# Altium project UWB_Anchor.PrjPcb
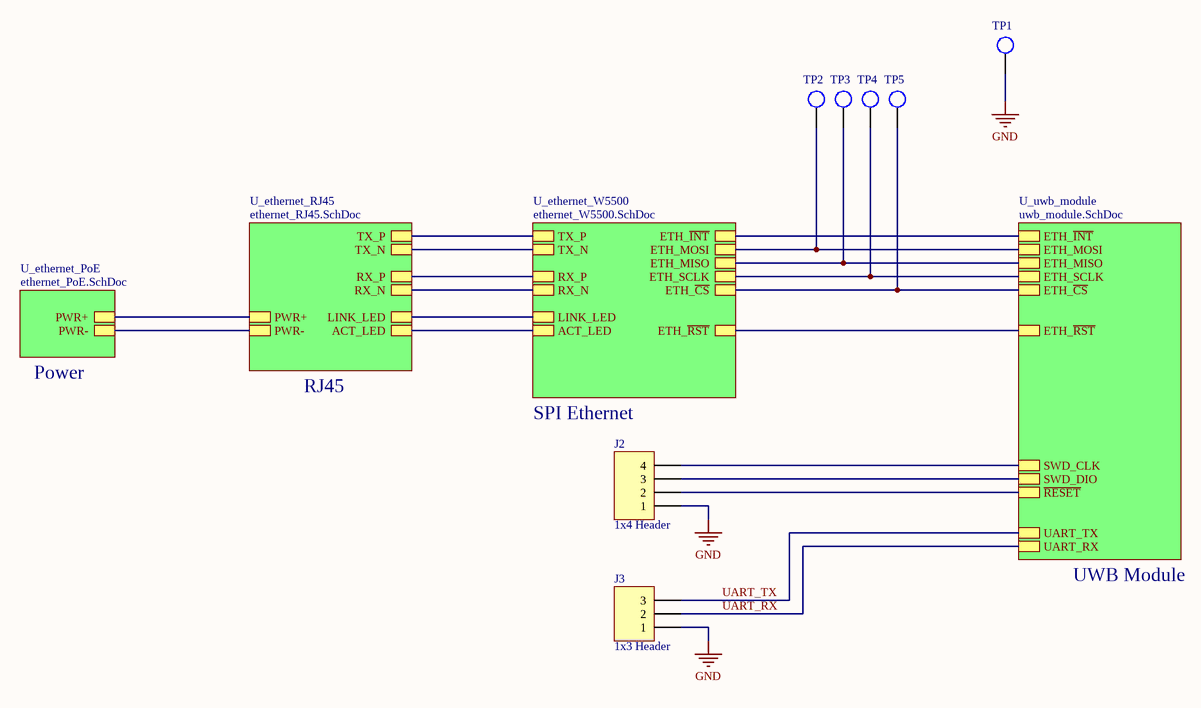
[diagram p0: main.SchDoc]
5 sheets, 101 parts. Net scope: hierarchical (ports join the sheet entries above them; power ports are global).
Board file: board.PcbDoc
Sheets:
  main.SchDoc
    U_ethernet_PoE = ethernet_PoE.SchDoc
    U_ethernet_RJ45 = ethernet_RJ45.SchDoc
    U_ethernet_W5500 = ethernet_W5500.SchDoc
    U_uwb_module = uwb_module.SchDoc

## Sheet main.SchDoc
size A4; SheetNumber: 1; SheetTotal: 5

### Parts
J2  1x4 Header  [HDR1X4]
J3  1x3 Header  [HDR1X3]
TP1  Test Point  [Test Point]  (value not drawn)  (no BOM)
TP2  Test Point  [Test Point]  (value not drawn)  (no BOM)
TP3  Test Point  [Test Point]  (value not drawn)  (no BOM)
TP4  Test Point  [Test Point]  (value not drawn)  (no BOM)
TP5  Test Point  [Test Point]  (value not drawn)  (no BOM)

### Sub-sheets
U_ethernet_PoE = ethernet_PoE.SchDoc: PWR-, PWR+
U_ethernet_RJ45 = ethernet_RJ45.SchDoc: LINK_LED, ACT_LED, TX_P, TX_N, RX_P, RX_N, PWR+, PWR-
U_ethernet_W5500 = ethernet_W5500.SchDoc: ETH_MOSI, ETH_MISO, ETH_SCLK, LINK_LED, ACT_LED, TX_P, TX_N, RX_P, RX_N, ETH_~{INT}, ETH_~{CS}, ETH_~{RST}
U_uwb_module = uwb_module.SchDoc: SWD_CLK, SWD_DIO, ETH_~{CS}, ETH_MOSI, ETH_MISO, ETH_SCLK, ETH_~{INT}, ETH_~{RST}, UART_TX, UART_RX, ~{RESET}

### Nets
GND: J2.1 J3.1 TP1.1
ACT_LED: sheet U_ethernet_RJ45/ACT_LED, sheet U_ethernet_W5500/ACT_LED
ETH_~{CS}: TP5.1 ; sheet U_ethernet_W5500/ETH_~{CS}, sheet U_uwb_module/ETH_~{CS}
ETH_~{INT}: sheet U_ethernet_W5500/ETH_~{INT}, sheet U_uwb_module/ETH_~{INT}
ETH_MISO: TP3.1 ; sheet U_ethernet_W5500/ETH_MISO, sheet U_uwb_module/ETH_MISO
ETH_MOSI: TP2.1 ; sheet U_ethernet_W5500/ETH_MOSI, sheet U_uwb_module/ETH_MOSI
ETH_~{RST}: sheet U_ethernet_W5500/ETH_~{RST}, sheet U_uwb_module/ETH_~{RST}
ETH_SCLK: TP4.1 ; sheet U_ethernet_W5500/ETH_SCLK, sheet U_uwb_module/ETH_SCLK
LINK_LED: sheet U_ethernet_RJ45/LINK_LED, sheet U_ethernet_W5500/LINK_LED
PWR+: sheet U_ethernet_PoE/PWR+, sheet U_ethernet_RJ45/PWR+
PWR-: sheet U_ethernet_PoE/PWR-, sheet U_ethernet_RJ45/PWR-
~{RESET}: J2.2 ; sheet U_uwb_module/~{RESET}
RX_N: sheet U_ethernet_RJ45/RX_N, sheet U_ethernet_W5500/RX_N
RX_P: sheet U_ethernet_RJ45/RX_P, sheet U_ethernet_W5500/RX_P
TX_N: sheet U_ethernet_RJ45/TX_N, sheet U_ethernet_W5500/TX_N
TX_P: sheet U_ethernet_RJ45/TX_P, sheet U_ethernet_W5500/TX_P
UART_RX: J3.2 ; sheet U_uwb_module/UART_RX
UART_TX: J3.3 ; sheet U_uwb_module/UART_TX
NetJ2_3: J2.3 ; sheet U_uwb_module/SWD_DIO
NetJ2_4: J2.4 ; sheet U_uwb_module/SWD_CLK

### Notes on the sheet
- Power
- RJ45
- (near J2) SPI Ethernet
- UWB Module

### Library data of the parts
J2 = 1x4 Header: 1x4 Pin Header
J3 = 1x3 Header: 1x3 Pin Header

## Sheet ethernet_PoE.SchDoc
size A4; SheetNumber: 3; SheetTotal: 5
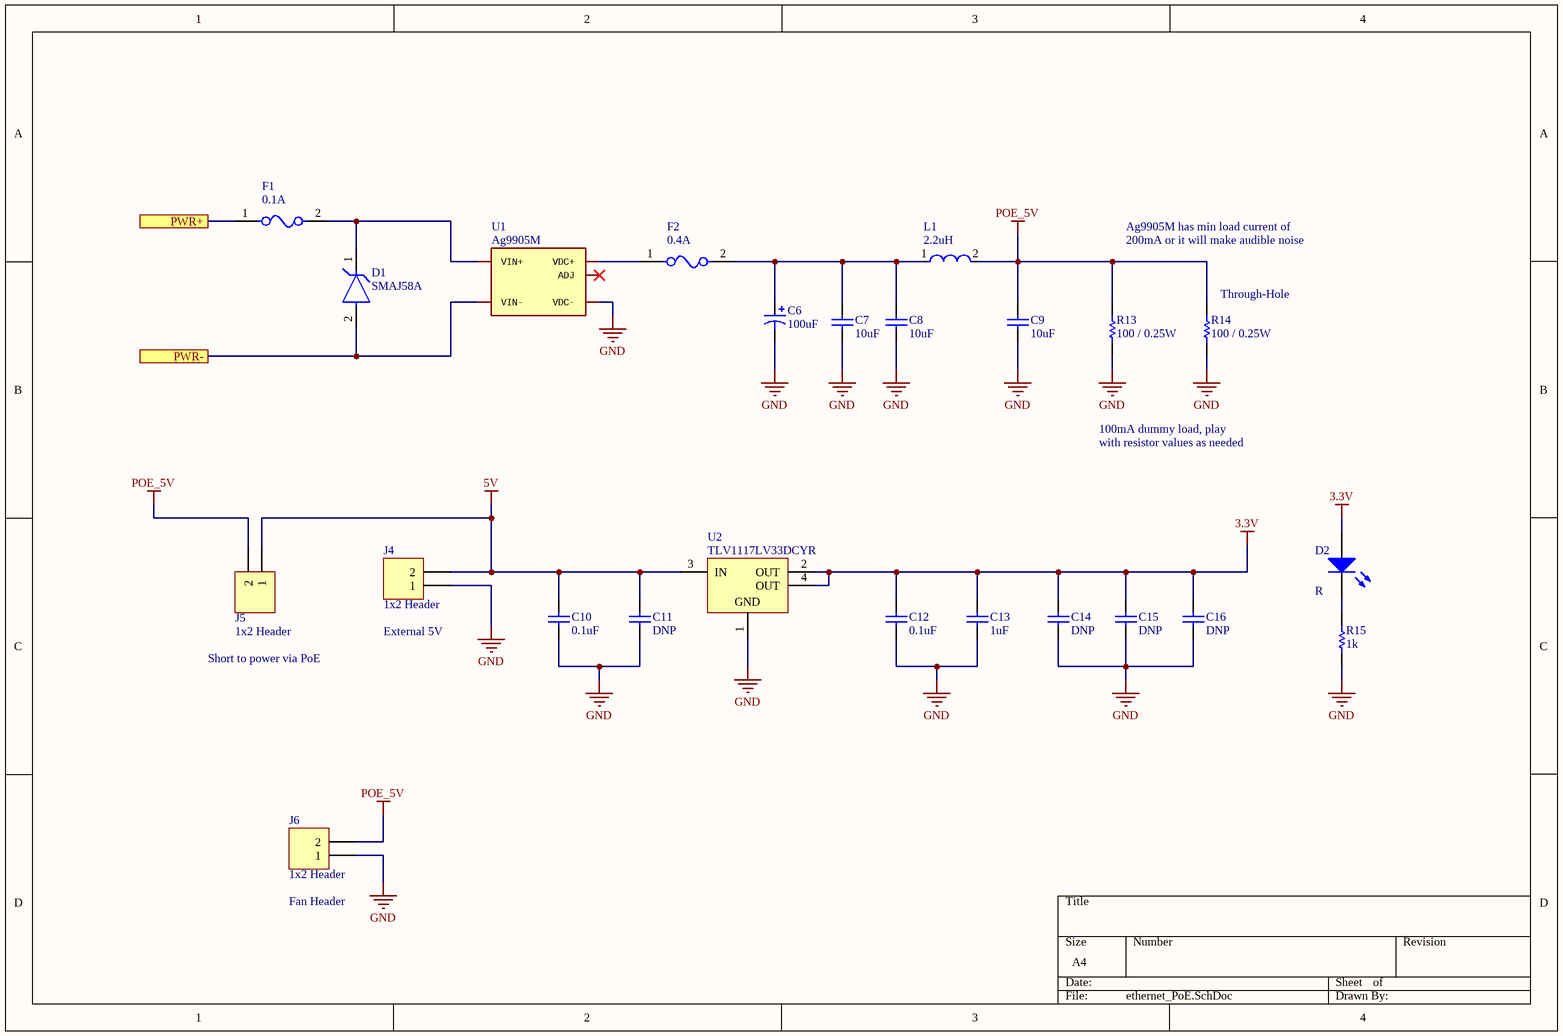
[diagram p1: ethernet_PoE.SchDoc]

### Parts
C6  value 100uF  [CAPPRD350W60D825H1300]  (hidden comment: Capacitor - Polarized)
C7  value 10uF  [0603 - Capacitor]  (hidden comment: Capacitor - Nonpolarized)
C8  value 10uF  [0603 - Capacitor]  (hidden comment: Capacitor - Nonpolarized)
C9  value 10uF  [0603 - Capacitor]  (hidden comment: Capacitor - Nonpolarized)
C10  value 0.1uF  [0603 - Capacitor]  (hidden comment: Capacitor - Nonpolarized)
C11  value DNP  [0603 - Capacitor]  (hidden comment: Capacitor - Nonpolarized)
C12  value 0.1uF  [0603 - Capacitor]  (hidden comment: Capacitor - Nonpolarized)
C13  value 1uF  [0603 - Capacitor]  (hidden comment: Capacitor - Nonpolarized)
C14  value DNP  [0603 - Capacitor]  (hidden comment: Capacitor - Nonpolarized)
C15  value DNP  [0603 - Capacitor]  (hidden comment: Capacitor - Nonpolarized)
C16  value DNP  [0603 - Capacitor]  (hidden comment: Capacitor - Nonpolarized)
D1  SMAJ58A  [FP-SMAJ-MFG]
D2  LED  [0805 LED]  (value not drawn)
F1  696101000002  [Wurth_0_MFG]  (value not drawn)
F2  696101000002  [Wurth_0_MFG]  (value not drawn)
J4  1x2 Header  [HDR1X2]
J5  1x2 Header  [HDR1X2]
J6  1x2 Header  [HDR1X2]
L1  2.2uH  [FP-DFE252010C-IPC_A]
R13  value 100 / 0.25W  [RESAD1100W55L680D260]  (hidden comment: Resistor)
R14  value 100 / 0.25W  [RESAD1100W55L680D260]  (hidden comment: Resistor)
R15  value 1k  [0603 - Resistor]  (hidden comment: Resistor)
U1  Ag9905M  [Ag9900m]
U2  TLV1117LV33DCYR  [DCY0004A_N]

### Ports
PWR+ (see main[1B]), PWR- (see main[1B])

### Nets
3.3V: C12.2 C13.2 C14.2 C15.2 C16.2 D2.1(A) U2.2(OUT) U2.4(OUT)
5V: C10.2 C11.2 J4.2 J5.1 U2.3(IN)
GND: C6.2 C7.1 C8.1 C9.1 C10.1 C11.1 C12.1 C13.1 C14.1 C15.1 C16.1 J4.1 J6.1 R13.1 R14.1 R15.1 U1.3(VDC-) U2.1(GND)
POE_5V: C9.2 J5.2 J6.2 L1.2 R13.2 R14.2
PWR+: F1.1 ; port PWR+
PWR-: D1.2(A) U1.7,8(VIN-) ; port PWR-
NetC6_1: C6.1 C7.2 C8.2 F2.2 L1.1
NetD1_1: D1.1(C) F1.2 U1.5,6(VIN+)
NetD2_2: D2.2(K) R15.2
NetF2_1: F2.1 U1.1,2(VDC+)

Not connected (* = marked no-connect by the designer): U1 4(ADJ)*

### Notes on the sheet
- (near F1) 0.1A
- (near F2) 0.4A
- Ag9905M has min load current of
- 200mA or it will make audible noise
- (near R14) Through-Hole
- 100mA dummy load, play
- with resistor values as needed
- (near J4) External 5V
- R
- Short to power via PoE
- (near J6) Fan Header

### Library data of the parts
C6 = Capacitor - Polarized: Polarized Capacitor; Manufacturer: Lelon; Manufacturer Part Number: RGA101M1HBK-0811G; Rating: 50V; Supplier: Mouser; Supplier Part Number: 140-RGA101M1HBK0811G; Link: https://www.mouser.ca/ProductDetail/Lelon/RGA101M1HBK-0811G?qs=pNDdEcSXiOBNivHdElCSJA%3D%3D
C7-C10 C12 = Capacitor - Nonpolarized: Nonpolarized Capacitor; Manufacturer: YAGEO; Manufacturer Part Number: CC0603KRX7R9BB104; Rating: 50V X7R +/-10%; Supplier Part Number: C14663; Supplier: JLCPCB; Link: https://jlcpcb.com/partdetail/Yageo-CC0603KRX7R9BB104/C14663
C11 C14-C16 = Capacitor - Nonpolarized: Nonpolarized Capacitor; Supplier Part Number: *; Supplier: *; Manufacturer: *; Rating: *; Manufacturer Part Number: *
C13 = Capacitor - Nonpolarized: Nonpolarized Capacitor; Manufacturer: Samsung Electro-Mechanics; Manufacturer Part Number: CL10A105KB8NNNC; Rating: 50V; Supplier Part Number: C15849; Supplier: JLCPCB; Link: https://jlcpcb.com/partdetail/16531-CL10A105KB8NNNC/C15849
D1 = CMP-08607-000100-1: TVS DIODE 58V 93.6V DO214AC; Manufacturer: Murata Electronics; Manufacturer Part Number: BLM21AG121SH1D; Link: https://www.mouser.ca/ProductDetail/Murata-Electronics/BLM21AG121SH1D?qs=RTwwdbUDBXC774LJBjqxGQ%3D%3D; Supplier: Mouser; Supplier Part Number: 81-BLM21AG121SH1D
D2 = LED: Light Emitting Diode; Manufacturer Part Number: NCD0805R1; Manufacturer: Foshan NationStar Optoelectronics; Value: *; Supplier Part Number: C84256; Rating: *; Supplier: JLCPCB; Link: https://jlcpcb.com/partdetail/85425-NCD0805R1/C84256
F1 F2 = 696101000002: Manufacturer: Wurth Elektronik; Link: https://www.mouser.ca/ProductDetail/Wurth-Elektronik/696101000002?qs=sGAEpiMZZMuxTAA0eeO5G4B6PR9Rh8ggTQiUs4G0%252BG%2FdkdTX7N7tpQ%3D%3D; Manufacturer Part Number: 696101000002; Supplier: Mouser; Supplier Part Number: 710-696101000002
J4-J6 = 1x2 Header: 1x2 Pin Header
L1 = CMP-06042-014626-1: Shielded Wirewound Inductor 2.2uH  1700mA 0.115Ω 1008 (2520); Manufacturer: Murata Electronics; Manufacturer Part Number: DFE252010P-2R2M=P2; Link: https://jlcpcb.com/parts/componentSearch?searchTxt=DFE252010P-2R2M%3DP2; Supplier: JLCPCB; Supplier Part Number: C882952
R15 = Resistor: Manufacturer Part Number: 0603WAF1001T5E; Manufacturer: UNI-ROYAL(Uniroyal Elec); Rating: 100mW; Supplier Part Number: C21190; Supplier: JLCPCB; Link: https://jlcpcb.com/partdetail/21904-0603WAF1001T5E/C21190
U1 = Ag99005M: pin to pad: 1,2>1+2 5,6>5+6 7,8>7+8; Manufacturer: Silvertel; Link: https://www.mouser.ca/ProductDetail/Silvertel/Ag9905M?qs=OlC7AqGiEDnwSueIfRW6OQ%3D%3D; Manufacturer Part Number: Ag9905M; Supplier: Mouser; Supplier Part Number: 480-AG9905M
U2 = CMP-0395-00503-2: Single Output LDO, 1 A, Fixed 3.3 V Output, 2 to 5.5 V Input, 4-pin SOT-223 (DCY), -40 to 125 degC, Green (RoHS & no Sb/Br); Manufacturer: Texas Instruments; Link: https://jlcpcb.com/partdetail/TexasInstruments-TLV1117LV33DCYR/C15578; Manufacturer Part Number: TLV1117LV33DCYR; Supplier: JLCPCB; Supplier Part Number: C15578

## Sheet ethernet_RJ45.SchDoc
size A4; SheetNumber: 2; SheetTotal: 5
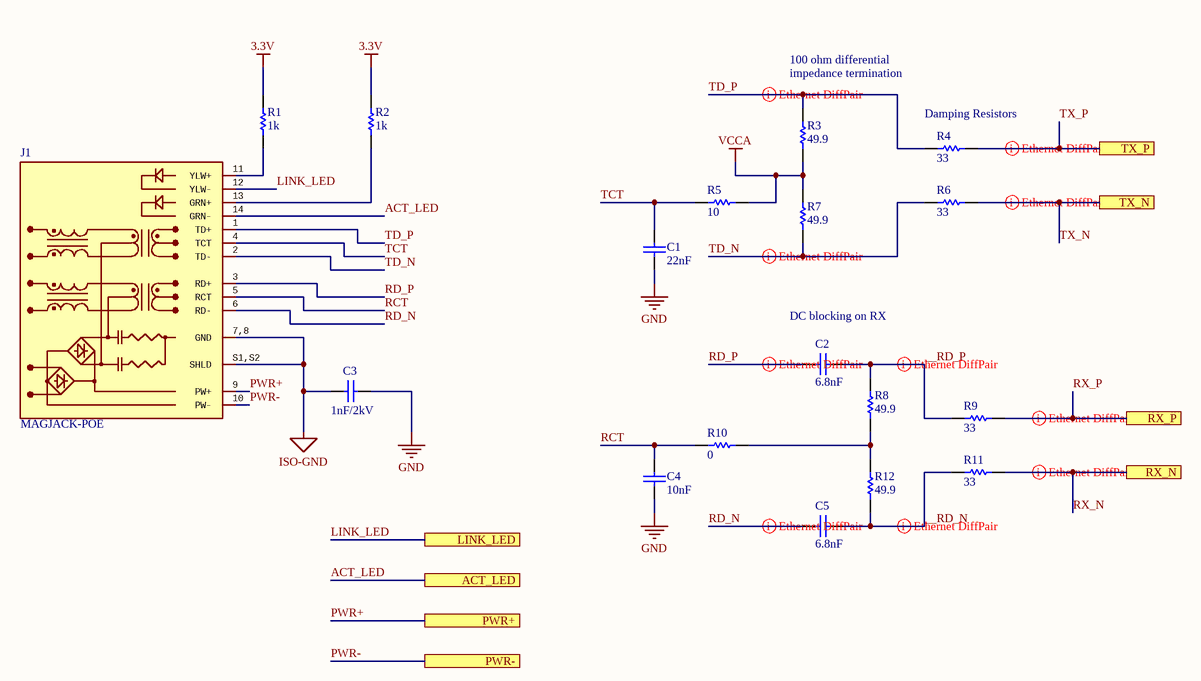
[diagram p2: ethernet_RJ45.SchDoc]

### Parts
C1  value 22nF  [0603 - Capacitor]  (hidden comment: Capacitor - Nonpolarized)
C2  value 6.8nF  [0603 - Capacitor]  (hidden comment: Capacitor - Nonpolarized)
C3  value 1nF/2kV  [1206 - Capacitor]  (hidden comment: Capacitor - Nonpolarized)
C4  value 10nF  [0603 - Capacitor]  (hidden comment: Capacitor - Nonpolarized)
C5  value 6.8nF  [0603 - Capacitor]  (hidden comment: Capacitor - Nonpolarized)
J1  MAGJACK-POE  [ARJP11A-MASA-B-A-EMU2]
R1  value 1k  [0603 - Resistor]  (hidden comment: Resistor)
R2  value 1k  [0603 - Resistor]  (hidden comment: Resistor)
R3  value 49.9  [0603 - Resistor]  (hidden comment: Resistor)
R4  value 33  [0603 - Resistor]  (hidden comment: Resistor)
R5  value 10  [0603 - Resistor]  (hidden comment: Resistor)
R6  value 33  [0603 - Resistor]  (hidden comment: Resistor)
R7  value 49.9  [0603 - Resistor]  (hidden comment: Resistor)
R8  value 49.9  [0603 - Resistor]  (hidden comment: Resistor)
R9  value 33  [0603 - Resistor]  (hidden comment: Resistor)
R10  value 0  [0603 - Resistor]  (hidden comment: Resistor)
R11  value 33  [0603 - Resistor]  (hidden comment: Resistor)
R12  value 49.9  [0603 - Resistor]  (hidden comment: Resistor)

### Ports
ACT_LED (see main[2B]), LINK_LED (see main[2B]), PWR+ (see main[2B]), PWR- (see main[2B]), RX_N (see main[2B]), RX_P (see main[2B]), TX_N (see main[2B]), TX_P (see main[2B])

### Nets
3.3V: R1.2 R2.2
GND: C1.1 C3.1 C4.1
ISO-GND: C3.2 J1.7,8(GND) J1.S1,S2(SHLD)
VCCA: R3.1 R5.1 R7.2
__RD_N: C5.1 R11.2 R12.1
__RD_P: C2.1 R8.2 R9.2
ACT_LED: J1.14(GRN-) ; port ACT_LED
LINK_LED: J1.12(YLW-) ; port LINK_LED
PWR+: J1.9(PW+) ; port PWR+
PWR-: J1.10(PW-) ; port PWR-
RCT: C4.2 J1.5(RCT) R10.2
RD_N: C5.2 J1.6(RD-)
RD_P: C2.2 J1.3(RD+)
RX_N: R11.1 ; port RX_N
RX_P: R9.1 ; port RX_P
TCT: C1.2 J1.4(TCT) R5.2
TD_N: J1.2(TD-) R6.2 R7.1
TD_P: J1.1(TD+) R3.2 R4.2
TX_N: R6.1 ; port TX_N
TX_P: R4.1 ; port TX_P
NetJ1_11: J1.11(YLW+) R1.1
NetJ1_13: J1.13(GRN+) R2.1
NetR8_1: R8.1 R10.1 R12.2

### Layout directives
differential pair; differential pair class Ethernet: __RD_N, __RD_P, RD_N, RD_P, RX_N, RX_P, TD_N, TD_P, TX_N, TX_P

### Notes on the sheet
- 100 ohm differential
- (near R3) impedance termination
- (near R4) Damping Resistors
- (near C2) DC blocking on RX

### Library data of the parts
C1 = Capacitor - Nonpolarized: Nonpolarized Capacitor; Manufacturer: Samsung Electro-Mechanics; Manufacturer Part Number: CL10B223KB8NNNC; Rating: 50V X7R +/-10%; Supplier Part Number: C21122; Supplier: JLCPCB; Link: https://jlcpcb.com/parts/componentSearch?searchTxt=C21122
C2 C5 = Capacitor - Nonpolarized: Nonpolarized Capacitor; Manufacturer: FH (Guangdong Fenghua Advanced Tech); Manufacturer Part Number: 0603B682K500NT; Rating: 50V X7R +/-10%; Supplier Part Number: C1631; Supplier: JLCPCB; Link: https://jlcpcb.com/partdetail/1983-0603B682K500NT/C1631
C3 = Capacitor - Nonpolarized: Nonpolarized Capacitor; Manufacturer: FH (Guangdong Fenghua Advanced Tech); Manufacturer Part Number: 1206B102K202NT; Rating: 2kV; Supplier Part Number: C9196; Supplier: JLCPCB; Link: https://jlcpcb.com/partdetail/9721-1206B102K202NT/C9196
C4 = Capacitor - Nonpolarized: Nonpolarized Capacitor; Manufacturer: FH (Guangdong Fenghua Advanced Tech); Manufacturer Part Number: 0603B103K500NT; Rating: 50V X7R +/-10%; Supplier Part Number: C57112; Supplier: JLCPCB; Link: https://jlcpcb.com/partdetail/58143-0603B103K500NT/C57112
J1 = ARJP11A-MASA-B-A-EMU2: pin to pad: 7,8>7+8 S1,S2>S1+S2; Manufacturer: ABRACON; Link: https://www.mouser.ca/ProductDetail/ABRACON/ARJP11A-MASA-B-A-EMU2?qs=Hi7jo9HHk1p0O4X8NyvNug%3D%3D; Manufacturer Part Number: ARJP11A-MASA-B-A-EMU2; Supplier: Mouser; Supplier Part Number: 815-RJP11AMASABAEMU2
R1 R2 = Resistor: as R15 on sheet ethernet_PoE; Supplier Part Number: C21190; Supplier: JLCPCB; Link: https://jlcpcb.com/partdetail/21904-0603WAF1001T5E/C21190
R3 R7 R8 R12 = Resistor: Manufacturer Part Number: 0603WAF499JT5E; Manufacturer: UNI-ROYAL(Uniroyal Elec); Rating: 100mW; Supplier Part Number: C23185; Supplier: JLCPCB; Link: https://jlcpcb.com/partdetail/23912-0603WAF499JT5E/C23185
R4 R6 R9 R11 = Resistor: Manufacturer Part Number: 0603WAF330JT5E; Manufacturer: UNI-ROYAL(Uniroyal Elec); Rating: 100mW; Supplier Part Number: C23140; Supplier: JLCPCB; Link: https://jlcpcb.com/partdetail/23867-0603WAF330JT5E/C23140
R5 = Resistor: Manufacturer Part Number: 0603WAF100JT5E; Manufacturer: UNI-ROYAL(Uniroyal Elec); Rating: 100mW; Supplier Part Number: C22859; Supplier: JLCPCB; Link: https://jlcpcb.com/partdetail/23586-0603WAF100JT5E/C22859
R10 = Resistor: Manufacturer Part Number: 0603WAF0000T5E; Manufacturer: UNI-ROYAL(Uniroyal Elec); Rating: 100mW; Supplier Part Number: C21189; Supplier: JLCPCB; Link: https://jlcpcb.com/partdetail/21903-0603WAF0000T5E/C21189

## Sheet ethernet_W5500.SchDoc
size A4; SheetNumber: 5; SheetTotal: 5
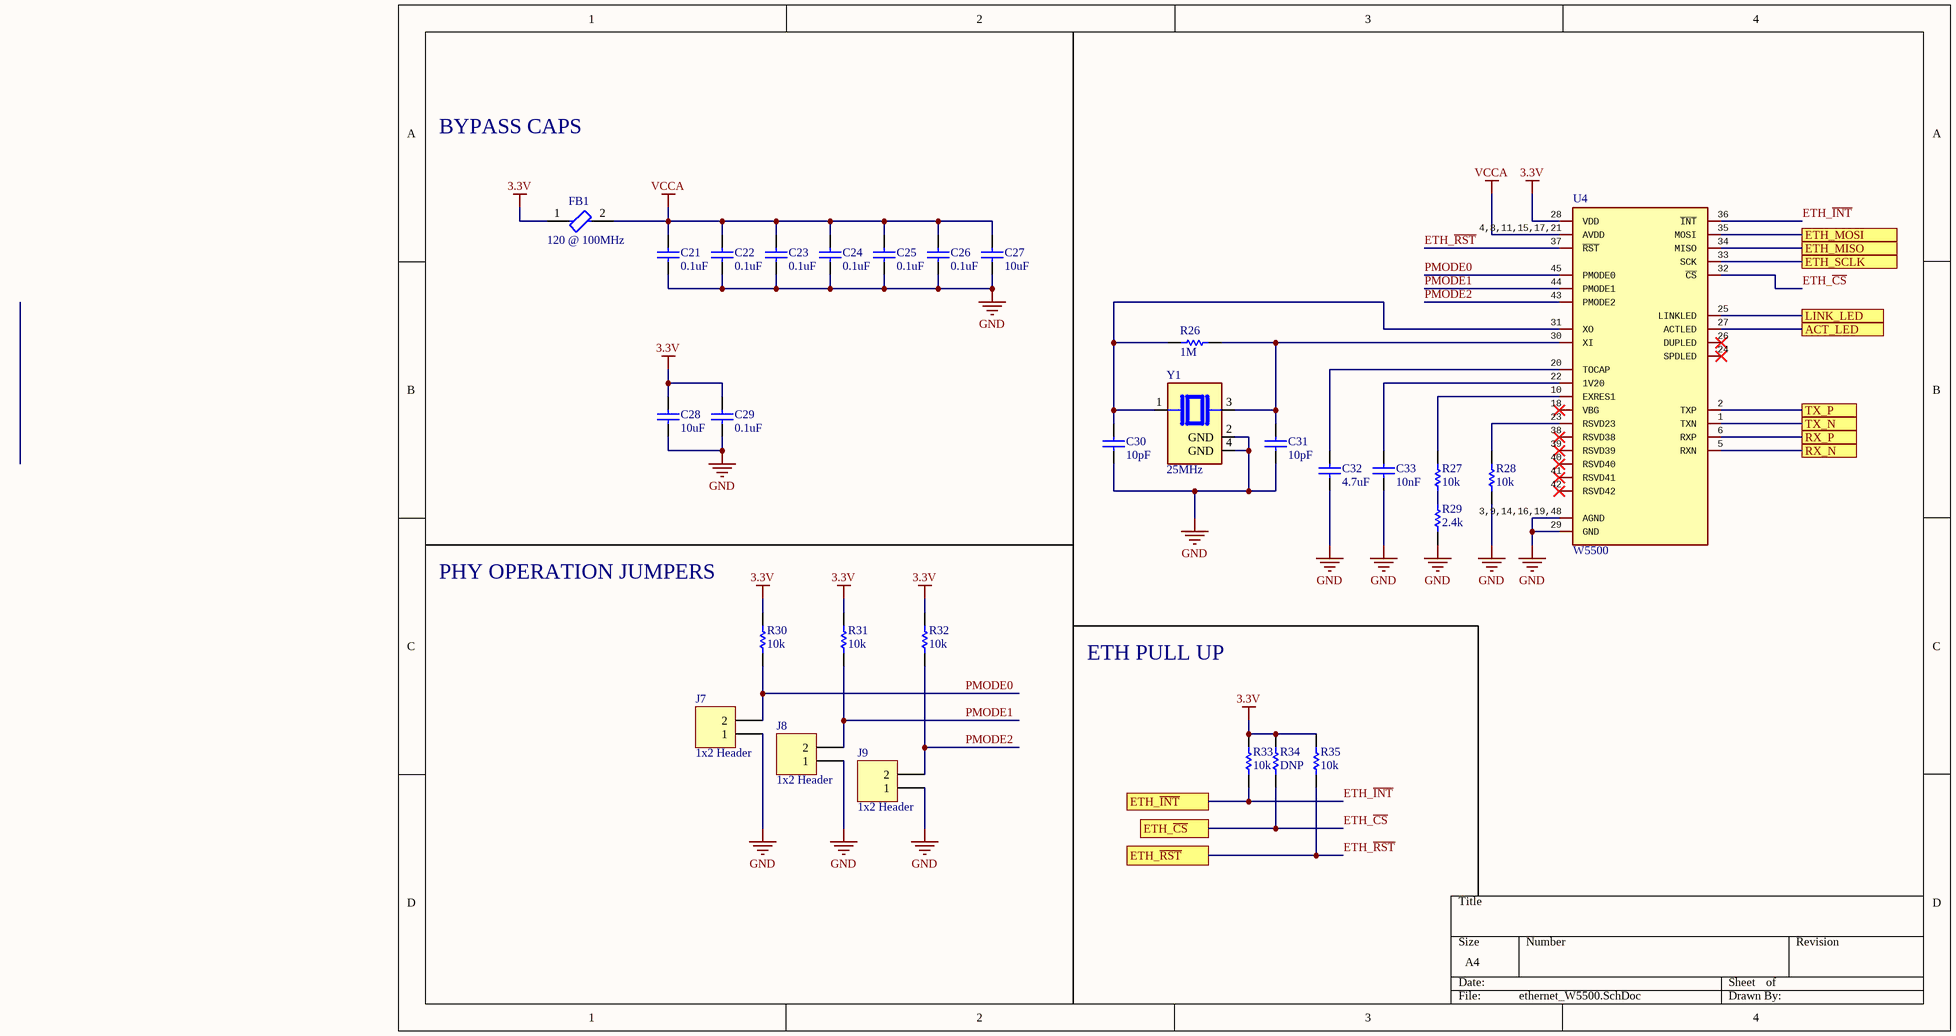
[diagram p3: ethernet_W5500.SchDoc]

### Parts
C21  value 0.1uF  [0603 - Capacitor]  (hidden comment: Capacitor - Nonpolarized)
C22  value 0.1uF  [0603 - Capacitor]  (hidden comment: Capacitor - Nonpolarized)
C23  value 0.1uF  [0603 - Capacitor]  (hidden comment: Capacitor - Nonpolarized)
C24  value 0.1uF  [0603 - Capacitor]  (hidden comment: Capacitor - Nonpolarized)
C25  value 0.1uF  [0603 - Capacitor]  (hidden comment: Capacitor - Nonpolarized)
C26  value 0.1uF  [0603 - Capacitor]  (hidden comment: Capacitor - Nonpolarized)
C27  value 10uF  [0603 - Capacitor]  (hidden comment: Capacitor - Nonpolarized)
C28  value 10uF  [0603 - Capacitor]  (hidden comment: Capacitor - Nonpolarized)
C29  value 0.1uF  [0603 - Capacitor]  (hidden comment: Capacitor - Nonpolarized)
C30  value 10pF  [0603 - Capacitor]  (hidden comment: Capacitor - Nonpolarized)
C31  value 10pF  [0603 - Capacitor]  (hidden comment: Capacitor - Nonpolarized)
C32  value 4.7uF  [0603 - Capacitor]  (hidden comment: Capacitor - Nonpolarized)
C33  value 10nF  [0603 - Capacitor]  (hidden comment: Capacitor - Nonpolarized)
FB1  120 @ 100MHz  [FP-BLM21-0_2-t0_85-e0_5-MFG]
J7  1x2 Header  [HDR1X2]
J8  1x2 Header  [HDR1X2]
J9  1x2 Header  [HDR1X2]
R26  value 1M  [0603 - Resistor]  (hidden comment: Resistor)
R27  value 10k  [0603 - Resistor]  (hidden comment: Resistor)
R28  value 10k  [0603 - Resistor]  (hidden comment: Resistor)
R29  value 2.4k  [0603 - Resistor]  (hidden comment: Resistor)
R30  value 10k  [0603 - Resistor]  (hidden comment: Resistor)
R31  value 10k  [0603 - Resistor]  (hidden comment: Resistor)
R32  value 10k  [0603 - Resistor]  (hidden comment: Resistor)
R33  value 10k  [0603 - Resistor]  (hidden comment: Resistor)
R34  value DNP  [0603 - Resistor]  (hidden comment: Resistor)
R35  value 10k  [0603 - Resistor]  (hidden comment: Resistor)
U4  W5500  [W5500]
Y1  25MHz  [XTAL_TSX-3225_25.0000MF20P-C0]

### Ports
ACT_LED (see main[2B], ethernet_RJ45[2C]), ETH_MISO (see main[3B], uwb_module[4C]), ETH_MOSI (see main[3B], uwb_module[4B]), ETH_SCLK (see main[3B], uwb_module[4C]), ETH_~{CS} (see main[3B], uwb_module[4B]), ETH_~{INT} (see main[3B], uwb_module[2C]), ETH_~{RST} (see main[3B], uwb_module[2C]), LINK_LED (see main[2B], ethernet_RJ45[2C]), RX_N (see main[2B], ethernet_RJ45[4C]), RX_P (see main[2B], ethernet_RJ45[4C]), TX_N (see main[2B], ethernet_RJ45[4B]), TX_P (see main[2B], ethernet_RJ45[4B])

### Nets
3.3V: C28.2 C29.2 FB1.1 R30.2 R31.2 R32.2 R33.2 R34.2 R35.2 U4.28(VDD)
GND: C21.1 C22.1 C23.1 C24.1 C25.1 C26.1 C27.1 C28.1 C29.1 C30.1 C31.1 C32.1 C33.1 J7.1 J8.1 J9.1 R28.1 R29.1 U4.3,9,14,16,19,48(AGND) U4.29(GND) Y1.2(GND) Y1.4(GND)
VCCA: C21.2 C22.2 C23.2 C24.2 C25.2 C26.2 C27.2 FB1.2 U4.4,8,11,15,17,21(AVDD)
ACT_LED: U4.27(ACTLED) ; port ACT_LED
ETH_~{CS}: R34.1 U4.32(~{CS}) ; port ETH_~{CS}
ETH_~{INT}: R33.1 U4.36(~{INT}) ; port ETH_~{INT}
ETH_MISO: U4.34(MISO) ; port ETH_MISO
ETH_MOSI: U4.35(MOSI) ; port ETH_MOSI
ETH_~{RST}: R35.1 U4.37(~{RST}) ; port ETH_~{RST}
ETH_SCLK: U4.33(SCK) ; port ETH_SCLK
LINK_LED: U4.25(LINKLED) ; port LINK_LED
PMODE0: J7.2 R30.1 U4.45(PMODE0)
PMODE1: J8.2 R31.1 U4.44(PMODE1)
PMODE2: J9.2 R32.1 U4.43(PMODE2)
RX_N: U4.5(RXN) ; port RX_N
RX_P: U4.6(RXP) ; port RX_P
TX_N: U4.1(TXN) ; port TX_N
TX_P: U4.2(TXP) ; port TX_P
NetC30_2: C30.2 R26.2 U4.31(XO) Y1.1
NetC31_2: C31.2 R26.1 U4.30(XI) Y1.3
NetC32_2: C32.2 U4.20(TOCAP)
NetC33_2: C33.2 U4.22(1V20)
NetR27_1: R27.1 R29.2
NetR27_2: R27.2 U4.10(EXRES1)
NetR28_2: R28.2 U4.23(RSVD23)

Not connected (* = marked no-connect by the designer): U4 18(VBG)* 24(SPDLED)* 26(DUPLED)* 38(RSVD38)* 39(RSVD39)* 40(RSVD40)* 41(RSVD41)* 42(RSVD42)*

### Notes on the sheet
- BYPASS CAPS
- PHY OPERATION JUMPERS
- ETH PULL UP

### Library data of the parts
C21-C29 = Capacitor - Nonpolarized: as C7 on sheet ethernet_PoE; Supplier Part Number: C14663; Supplier: JLCPCB; Link: https://jlcpcb.com/partdetail/Yageo-CC0603KRX7R9BB104/C14663
C30 C31 = Capacitor - Nonpolarized: Nonpolarized Capacitor; Manufacturer: Samsung Electro-Mechanics; Manufacturer Part Number: CL10C100JB8NNNC; Rating: 50V C0G +/-5%; Supplier Part Number: C1634; Supplier: JLCPCB; Link: https://jlcpcb.com/partdetail/1986-CL10C100JB8NNNC/C1634
C32 = Capacitor - Nonpolarized: Nonpolarized Capacitor; Manufacturer: Samsung Electro-Mechanics; Manufacturer Part Number: CL10A475KO8NNNC; Rating: 16V X5R +/-10%; Supplier Part Number: C19666; Supplier: JLCPCB; Link: https://jlcpcb.com/partdetail/20375-CL10A475KO8NNNC/C19666
C33 = Capacitor - Nonpolarized: as C4 on sheet ethernet_RJ45; Supplier Part Number: C57112; Supplier: JLCPCB; Link: https://jlcpcb.com/partdetail/58143-0603B103K500NT/C57112
FB1 = CMP-06046-002573-1: Chip Ferrite Bead, 0805, 120Ω @ 100MHz, 0.09Ω, 25%, 1A; Manufacturer: Murata Electronics; Manufacturer Part Number: BLM21AG121SH1D; Supplier: Mouser; Link: https://www.mouser.ca/ProductDetail/Murata-Electronics/BLM21AG121SH1D?qs=RTwwdbUDBXC774LJBjqxGQ%3D%3D; Supplier Part Number: 81-BLM21AG121SH1D
J7-J9 = 1x2 Header: 1x2 Pin Header
R26 = Resistor: Manufacturer Part Number: 0603WAF1004T5E; Manufacturer: UNI-ROYAL(Uniroyal Elec); Rating: 100mW; Supplier Part Number: C22935; Supplier: JLCPCB; Link: https://jlcpcb.com/partdetail/23662-0603WAF1004T5E/C22935
R27 R28 R30-R33 R35 = Resistor: Manufacturer Part Number: 0603WAF1002T5E; Manufacturer: UNI-ROYAL(Uniroyal Elec); Rating: 100mW; Supplier Part Number: C25804; Supplier: JLCPCB; Link: https://jlcpcb.com/partdetail/26547-0603WAF1002T5E/C25804
R29 = Resistor: Manufacturer Part Number: 0603WAF2401T5E; Manufacturer: UNI-ROYAL(Uniroyal Elec); Rating: 100mW; Supplier Part Number: C22940; Supplier: JLCPCB; Link: https://jlcpcb.com/partdetail/23667-0603WAF2401T5E/C22940
U4 = W5500: pin to pad: 3,9,14,16,19,48>3+9+14+16+19+48 4,8,11,15,17,21>4+8+11+15+17+21; Manufacturer: WIZNET; Link: https://jlcpcb.com/partdetail/Wiznet-W5500/C32843; Manufacturer Part Number: W5500; Supplier: JLCPCB; Supplier Part Number: C32843
Y1 = TSX-3225_25.0000MF20P-C0: 25 MHz Â±10ppm Crystal 18pF 40 Ohms 4-SMD, No Lead; Manufacturer Part Number: X322525MOB4SI; Manufacturer: Yangxing Tech; Supplier Part Number: C9006; Supplier: JLCPCB; Link: https://jlcpcb.com/partdetail/YangxingTech-X322525MOB4SI/C9006; Value: 25MHz
R34 = Resistor: Rating: *; Manufacturer Part Number: *; Manufacturer: *; Supplier Part Number: *; Supplier: *

## Sheet uwb_module.SchDoc
size A4; SheetNumber: 4; SheetTotal: 5
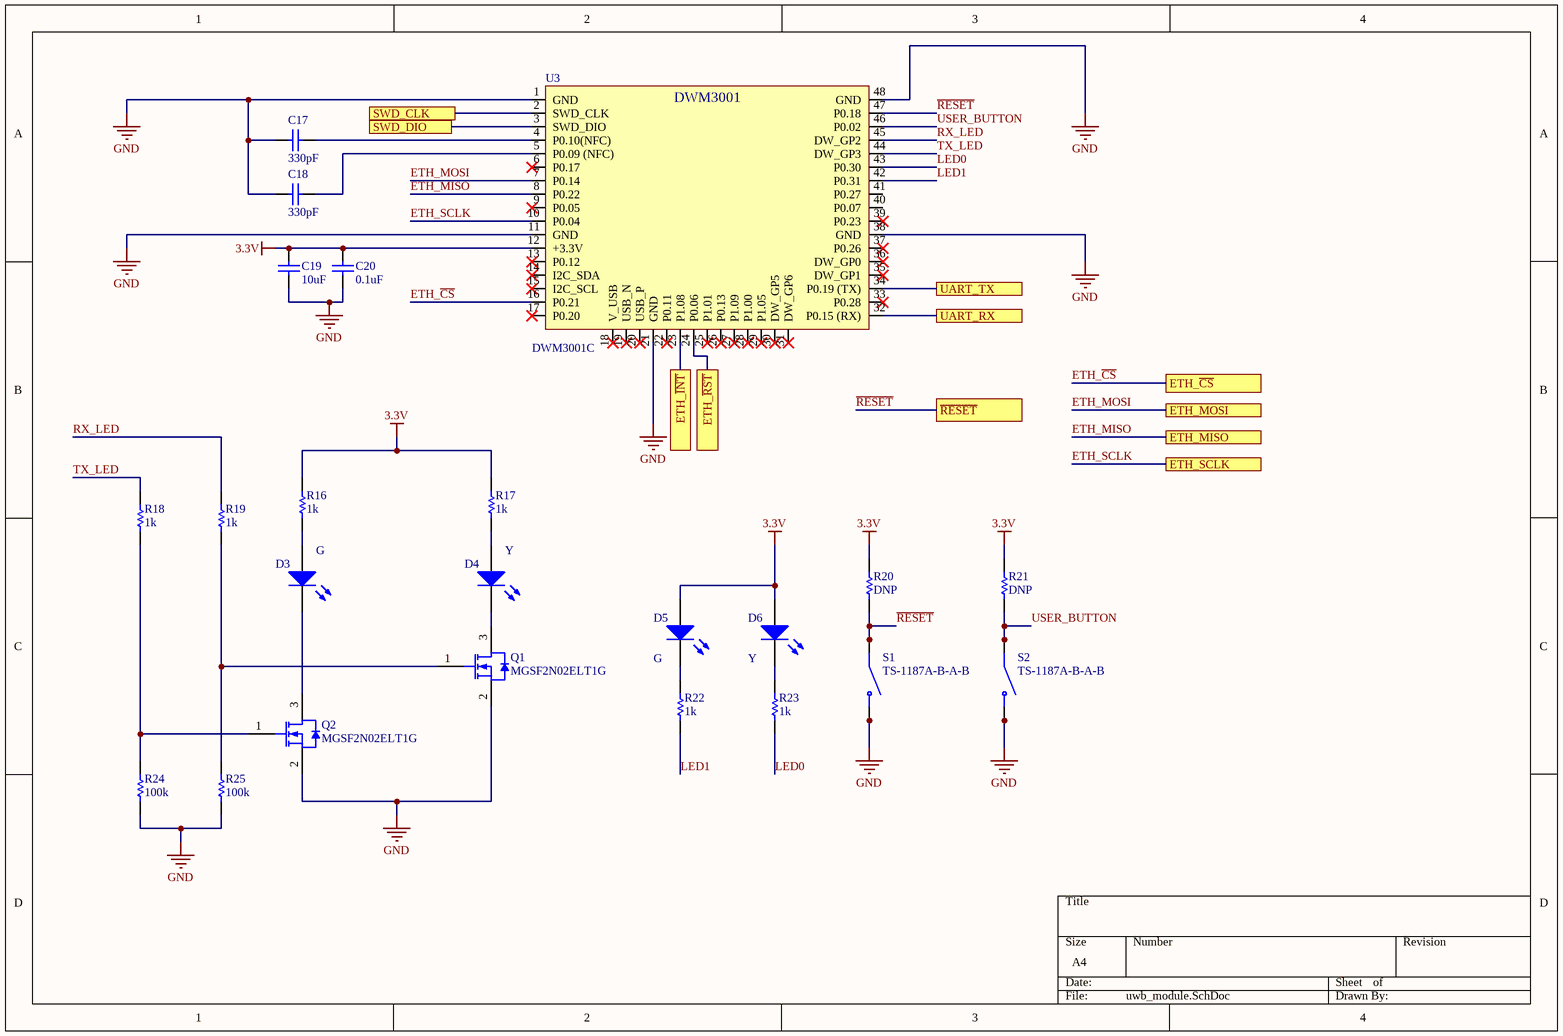
[diagram p4: uwb_module.SchDoc]

### Parts
C17  value 330pF  [0603 - Capacitor]  (hidden comment: Capacitor - Nonpolarized)
C18  value 330pF  [0603 - Capacitor]  (hidden comment: Capacitor - Nonpolarized)
C19  value 10uF  [0603 - Capacitor]  (hidden comment: Capacitor - Nonpolarized)
C20  value 0.1uF  [0603 - Capacitor]  (hidden comment: Capacitor - Nonpolarized)
D3  LED  [0805 LED]  (value not drawn)
D4  LED  [0805 LED]  (value not drawn)
D5  LED  [0805 LED]  (value not drawn)
D6  LED  [0805 LED]  (value not drawn)
Q1  MGSF2N02ELT1G  [ONSC-SOT-23-3-318-08_V]
Q2  MGSF2N02ELT1G  [ONSC-SOT-23-3-318-08_V]
R16  value 1k  [0603 - Resistor]  (hidden comment: Resistor)
R17  value 1k  [0603 - Resistor]  (hidden comment: Resistor)
R18  value 1k  [0603 - Resistor]  (hidden comment: Resistor)
R19  value 1k  [0603 - Resistor]  (hidden comment: Resistor)
R20  value DNP  [0603 - Resistor]  (hidden comment: Resistor)
R21  value DNP  [0603 - Resistor]  (hidden comment: Resistor)
R22  value 1k  [0603 - Resistor]  (hidden comment: Resistor)
R23  value 1k  [0603 - Resistor]  (hidden comment: Resistor)
R24  value 100k  [0603 - Resistor]  (hidden comment: Resistor)
R25  value 100k  [0603 - Resistor]  (hidden comment: Resistor)
S1  TS-1187A-B-A-B  [SW_TS-1187A-B-A-B]
S2  TS-1187A-B-A-B  [SW_TS-1187A-B-A-B]
U3  DWM3001C  [DWM3001C]

### Ports
ETH_MISO (see main[4B]), ETH_MOSI (see main[4B]), ETH_SCLK (see main[4B]), ETH_~{CS} (see main[4B]), ETH_~{INT} (see main[4B]), ETH_~{RST} (see main[4B]), SWD_CLK (see main[4C]), SWD_DIO (see main[4C]), UART_RX (see main[4C]), UART_TX (see main[4C]), ~{RESET} (see main[4C])

### Nets
3.3V: C19.1 C20.1 D5.1(A) D6.1(A) R16.2 R17.2 R20.2 R21.2 U3.12(+3.3V)
GND: C17.2 C18.2 C19.2 C20.2 Q1.2(S) Q2.2(S) R24.1 R25.1 S1.C(NO) S1.D(NO) S2.C(NO) S2.D(NO) U3.1(GND) U3.11(GND) U3.21(GND) U3.38(GND) U3.48(GND)
ETH_~{CS}: U3.16(P0.21) ; port ETH_~{CS}
ETH_~{INT}: U3.23(P1.08) ; port ETH_~{INT}
ETH_MISO: U3.8(P0.22) ; port ETH_MISO
ETH_MOSI: U3.7(P0.14) ; port ETH_MOSI
ETH_~{RST}: U3.24(P0.06) ; port ETH_~{RST}
ETH_SCLK: U3.10(P0.04) ; port ETH_SCLK
LED0: R23.1 U3.43(P0.30)
LED1: R22.1 U3.42(P0.31)
~{RESET}: R20.1 S1.A(COM) S1.B(COM) U3.47(P0.18) ; port ~{RESET}
RX_LED: R19.2 U3.45(DW_GP2)
TX_LED: R18.2 U3.44(DW_GP3)
UART_RX: U3.32(P0.15_(RX)) ; port UART_RX
UART_TX: U3.34(P0.19_(TX)) ; port UART_TX
USER_BUTTON: R21.1 S2.A(COM) S2.B(COM) U3.46(P0.02)
NetC17_1: C17.1 U3.4(P0.10(NFC))
NetC18_1: C18.1 U3.5(P0.09_(NFC))
NetD3_1: D3.1(A) R16.1
NetD3_2: D3.2(K) Q2.3(D)
NetD4_1: D4.1(A) R17.1
NetD4_2: D4.2(K) Q1.3(D)
NetD5_2: D5.2(K) R22.2
NetD6_2: D6.2(K) R23.2
NetJ2_3: U3.3(SWD_DIO) ; port SWD_DIO
NetJ2_4: U3.2(SWD_CLK) ; port SWD_CLK
NetQ1_1: Q1.1(G) R19.1 R25.2
NetQ2_1: Q2.1(G) R18.1 R24.2

Not connected (* = marked no-connect by the designer): U3 6(P0.17)* 9(P0.05)* 13(P0.12)* 14(I2C_SDA)* 15(I2C_SCL)* 17(P0.20)* 18(V_USB)* 19(USB_N)* 20(USB_P)* 22(P0.11)* 25(P1.01)* 26(P0.13)* 27(P1.09)* 28(P1.00)* 29(P1.05)* 30(DW_GP5)* 31(DW_GP6)* 33(P0.28)* 35(DW_GP1)* 36(DW_GP0)* 37(P0.26)* 39(P0.23)* 40(P0.07) 41(P0.27)

### Notes on the sheet
- G
- Y
- (in symbol DWM3001C) DWM3001

### Library data of the parts
C17 C18 = Capacitor - Nonpolarized: Nonpolarized Capacitor; Manufacturer: Samsung Electro-Mechanics; Manufacturer Part Number: CL10C331JB8NNNC; Rating: 50V; Supplier Part Number: C1664; Supplier: JLCPCB; Link: https://jlcpcb.com/partdetail/2016-CL10C331JB8NNNC/C1664
C19 C20 = Capacitor - Nonpolarized: as C7 on sheet ethernet_PoE; Supplier Part Number: C14663; Supplier: JLCPCB; Link: https://jlcpcb.com/partdetail/Yageo-CC0603KRX7R9BB104/C14663
D3 D5 = LED: Light Emitting Diode; Manufacturer Part Number: C2297; Manufacturer: Hubei KENTO Elec; Value: *; Supplier Part Number: C2297; Rating: *; Supplier: JLCPCB; Link: https://jlcpcb.com/partdetail/Hubei_KentoElec-C2297/C2297
D4 D6 = LED: Light Emitting Diode; Manufacturer Part Number: C2296; Manufacturer: Hubei KENTO Elec; Value: *; Supplier Part Number: C2296; Rating: *; Supplier: JLCPCB; Link: https://jlcpcb.com/partdetail/Hubei_KentoElec-C2296/C2296
Q1 Q2 = CMP-1058-00775-1: Power MOSFET, 2.8 A, 20 V, N-Channel, 3-Pin SOT-23, Pb-Free, Tape and Reel; Manufacturer: On Semiconductor; Link: https://jlcpcb.com/partdetail/Onsemi-MGSF2N02ELT1G/C236232; Manufacturer Part Number: MGSF2N02ELT1G; Supplier: JLCPCB; Supplier Part Number: C236232
R16-R19 R22 R23 = Resistor: as R15 on sheet ethernet_PoE; Supplier Part Number: C21190; Supplier: JLCPCB; Link: https://jlcpcb.com/partdetail/21904-0603WAF1001T5E/C21190
R24 R25 = Resistor: Manufacturer Part Number: 0603WAF1003T5E; Manufacturer: UNI-ROYAL(Uniroyal Elec); Rating: 100mW; Supplier Part Number: C25803; Supplier: JLCPCB; Link: https://jlcpcb.com/partdetail/26546-0603WAF1003T5E/C25803
S1 S2 = TS-1187A-B-A-B: SPST 50mA @ 12VDC Top Actuated Round Button 160gf SMD Tactile Switches RoHS; Manufacturer: XKB Connectivity; Value: *; Supplier: JLCPCB; Manufacturer Part Number: TS-1187A-B-A-B; Supplier Part Number: C318884
  S1: Link: https://jlcpcb.com/partdetail/XkbConnectivity-TS_1187A_B_AB/C318884
U3 = DWM3001C: Manufacturer: Qorvo; Link: https://store.qorvo.com/products/detail/dwm3001c-qorvo/692453/; Manufacturer Part Number: DWM3001C; Supplier: Qorvo; Supplier Part Number: DWM3001C
R20 R21 = Resistor: Rating: *; Manufacturer Part Number: *; Manufacturer: *; Supplier Part Number: *; Supplier: *

## Nets that join several sheets
3.3V: ethernet_PoE (8 pins), ethernet_RJ45 (R1.2 R2.2), ethernet_W5500 (10 pins), uwb_module (9 pins)
GND: main (J2.1 J3.1 TP1.1), ethernet_PoE (18 pins), ethernet_RJ45 (C1.1 C3.1 C4.1), ethernet_W5500 (22 pins), uwb_module (17 pins)
VCCA: ethernet_RJ45 (R3.1 R5.1 R7.2), ethernet_W5500 (9 pins)
ACT_LED: ethernet_RJ45 (J1.14), ethernet_W5500 (U4.27)
ETH_~{CS}: main (TP5.1), ethernet_W5500 (R34.1 U4.32), uwb_module (U3.16)
ETH_~{INT}: ethernet_W5500 (R33.1 U4.36), uwb_module (U3.23)
ETH_MISO: main (TP3.1), ethernet_W5500 (U4.34), uwb_module (U3.8)
ETH_MOSI: main (TP2.1), ethernet_W5500 (U4.35), uwb_module (U3.7)
ETH_~{RST}: ethernet_W5500 (R35.1 U4.37), uwb_module (U3.24)
ETH_SCLK: main (TP4.1), ethernet_W5500 (U4.33), uwb_module (U3.10)
LINK_LED: ethernet_RJ45 (J1.12), ethernet_W5500 (U4.25)
NetJ2_3: main (J2.3), uwb_module (U3.3)
NetJ2_4: main (J2.4), uwb_module (U3.2)
PWR+: ethernet_PoE (F1.1), ethernet_RJ45 (J1.9)
PWR-: ethernet_PoE (D1.2 U1.7,8), ethernet_RJ45 (J1.10)
~{RESET}: main (J2.2), uwb_module (R20.1 S1.A S1.B U3.47)
RX_N: ethernet_RJ45 (R11.1), ethernet_W5500 (U4.5)
RX_P: ethernet_RJ45 (R9.1), ethernet_W5500 (U4.6)
TX_N: ethernet_RJ45 (R6.1), ethernet_W5500 (U4.1)
TX_P: ethernet_RJ45 (R4.1), ethernet_W5500 (U4.2)
UART_RX: main (J3.2), uwb_module (U3.32)
UART_TX: main (J3.3), uwb_module (U3.34)